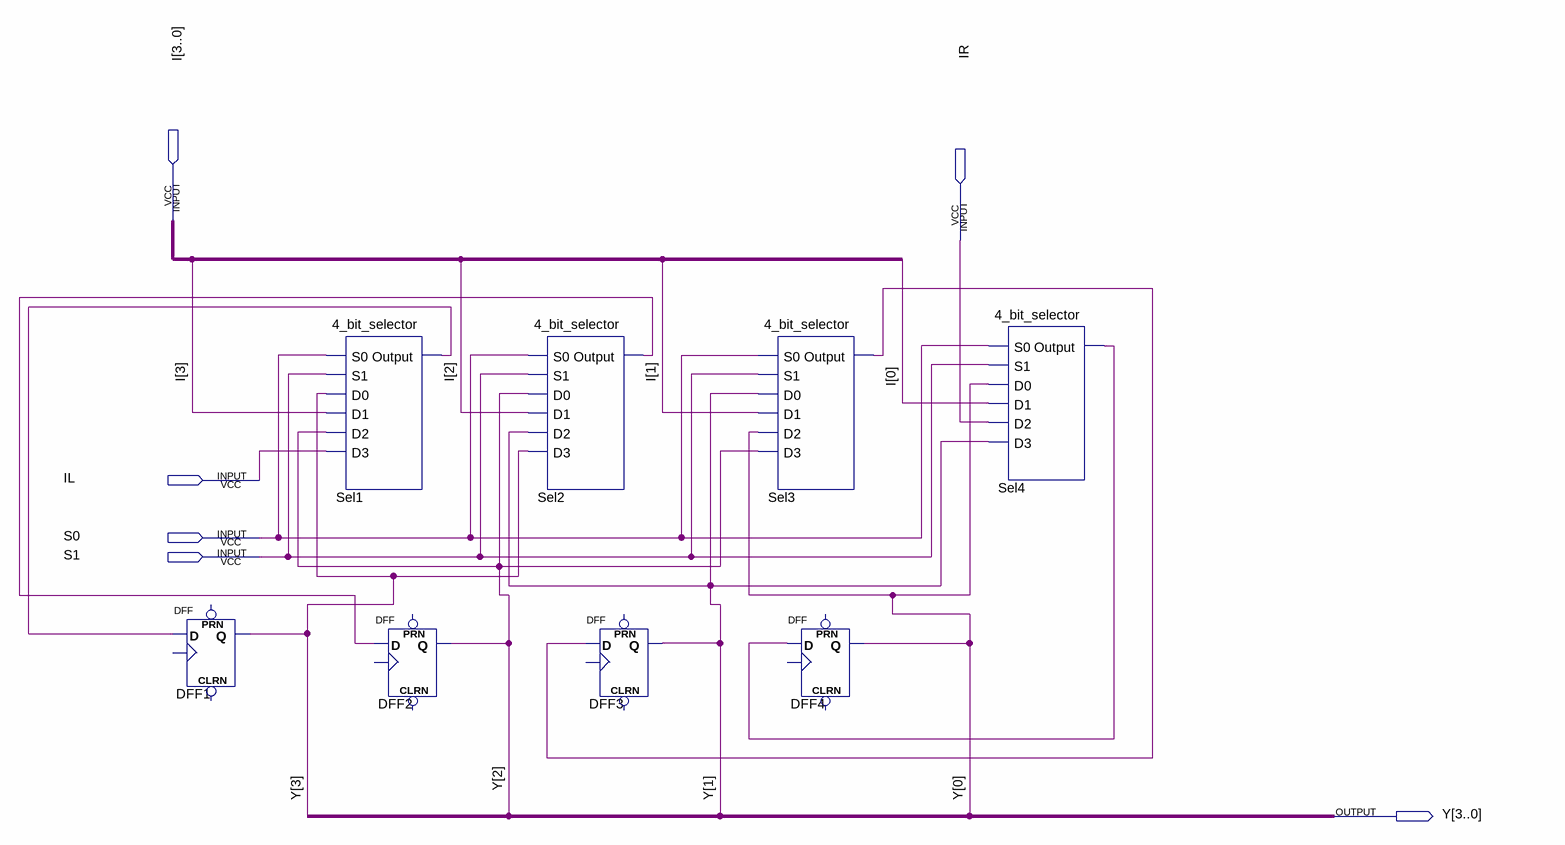
[diagram p0: schematic sheet]
// Quartus schematic Accumulator.bdf as structural Verilog: 8 symbols, 6 pins
module Accumulator (
  input  [3:0] I,
  input  IR,
  input  IL,
  input  S0,
  input  S1,
  output [3:0] Y
);

  wire Sel1_output, Sel2_output, Sel3_output, Sel4_output;

  DFF DFF1 (.D(Sel1_output), .Q(Y[3]));  // open: CLRN, CLK, PRN
  \4_bit_selector  Sel1 (.S0(S0), .S1(S1), .D0(Y[3]), .D1(I[3]), .D2(Y[2]), .D3(IL), .Output(Sel1_output));
  DFF DFF2 (.D(Sel2_output), .Q(Y[2]));  // open: CLRN, CLK, PRN
  \4_bit_selector  Sel2 (.S0(S0), .S1(S1), .D0(Y[2]), .D1(I[2]), .D2(Y[1]), .D3(Y[3]), .Output(Sel2_output));
  DFF DFF3 (.D(Sel3_output), .Q(Y[1]));  // open: CLRN, CLK, PRN
  \4_bit_selector  Sel3 (.S0(S0), .S1(S1), .D0(Y[1]), .D1(I[1]), .D2(Y[0]), .D3(Y[2]), .Output(Sel3_output));
  DFF DFF4 (.D(Sel4_output), .Q(Y[0]));  // open: CLRN, CLK, PRN
  \4_bit_selector  Sel4 (.S0(S0), .S1(S1), .D0(Y[0]), .D1(I[0]), .D2(IR), .D3(Y[1]), .Output(Sel4_output));
endmodule
